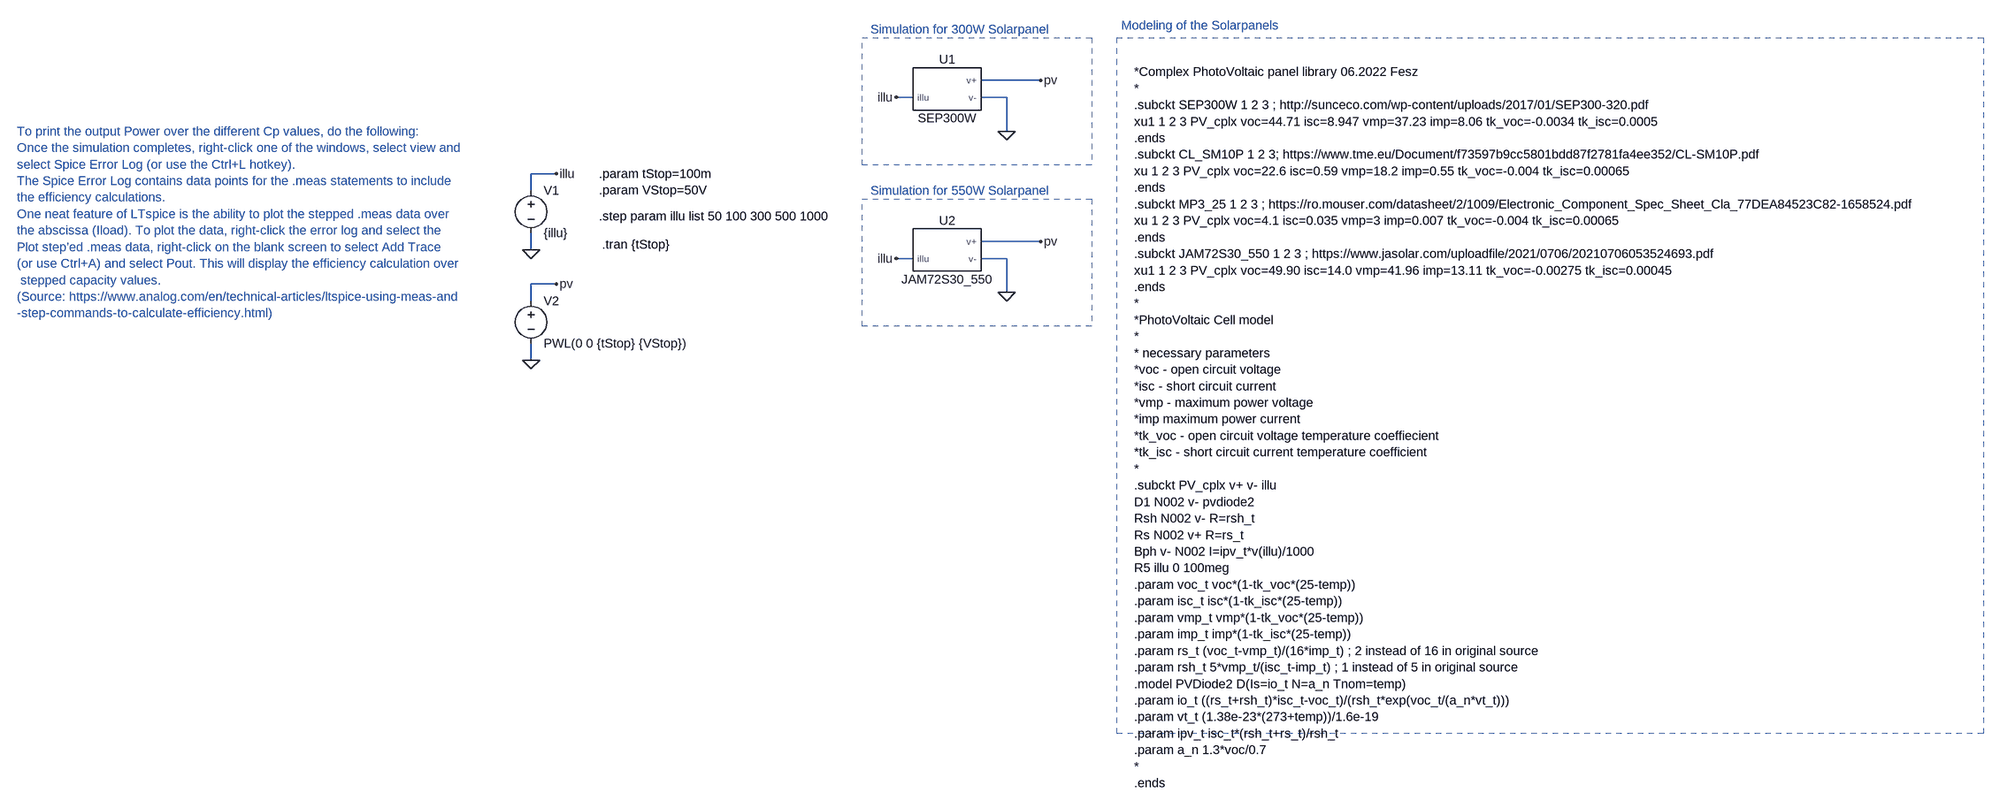
[diagram p0: schematic pv-panel-input.asc]
pv-panel-input.asc, the LTspice schematic file:
Version 4
SHEET 1 2356 1348
WIRE -1248 112 -1360 112
WIRE -1488 144 -1520 144
WIRE -1312 144 -1360 144
WIRE -1312 208 -1312 144
WIRE -2160 288 -2208 288
WIRE -2208 320 -2208 288
WIRE -1248 416 -1360 416
WIRE -2208 432 -2208 400
WIRE -1488 448 -1520 448
WIRE -1312 448 -1360 448
WIRE -2160 496 -2208 496
WIRE -1312 512 -1312 448
WIRE -2208 528 -2208 496
WIRE -2208 640 -2208 608
FLAG -2208 432 0
FLAG -1312 208 0
FLAG -2160 288 illu
FLAG -1520 144 illu
FLAG -1312 512 0
FLAG -1520 448 illu
FLAG -2208 640 0
FLAG -2160 496 pv
FLAG -1248 112 pv
FLAG -1248 416 pv
SYMBOL PV_cplx -1424 128 R0
SYMATTR InstName U1
SYMATTR Value SEP300W
SYMBOL voltage -2208 304 R0
WINDOW 123 0 0 Left 0
WINDOW 39 0 0 Left 0
SYMATTR InstName V1
SYMATTR Value {illu}
SYMBOL PV_cplx -1424 432 R0
SYMATTR InstName U2
SYMATTR Value JAM72S30_550
SYMBOL voltage -2208 512 R0
WINDOW 123 0 0 Left 0
WINDOW 39 0 0 Left 0
SYMATTR InstName V2
SYMATTR Value PWL(0 0 {tStop} {VStop})
TEXT -1072 96 Left 2 !*Complex PhotoVoltaic panel library 06.2022 Fesz\n*\n.subckt SEP300W 1 2 3 ; http://sunceco.com/wp-content/uploads/2017/01/SEP300-320.pdf\nxu1 1 2 3 PV_cplx voc=44.71 isc=8.947 vmp=37.23 imp=8.06 tk_voc=-0.0034 tk_isc=0.0005\n.ends\n.subckt CL_SM10P 1 2 3; https://www.tme.eu/Document/f73597b9cc5801bdd87f2781fa4ee352/CL-SM10P.pdf\nxu 1 2 3 PV_cplx voc=22.6 isc=0.59 vmp=18.2 imp=0.55 tk_voc=-0.004 tk_isc=0.00065\n.ends\n.subckt MP3_25 1 2 3 ; https://ro.mouser.com/datasheet/2/1009/Electronic_Component_Spec_Sheet_Cla_77DEA84523C82-1658524.pdf\nxu 1 2 3 PV_cplx voc=4.1 isc=0.035 vmp=3 imp=0.007 tk_voc=-0.004 tk_isc=0.00065\n.ends\n.subckt JAM72S30_550 1 2 3 ; https://www.jasolar.com/uploadfile/2021/0706/20210706053524693.pdf\nxu1 1 2 3 PV_cplx voc=49.90 isc=14.0 vmp=41.96 imp=13.11 tk_voc=-0.00275 tk_isc=0.00045\n.ends\n*\n*PhotoVoltaic Cell model\n*\n* necessary parameters\n*voc - open circuit voltage\n*isc - short circuit current\n*vmp - maximum power voltage\n*imp maximum power current\n*tk_voc - open circuit voltage temperature coeffiecient\n*tk_isc - short circuit current temperature coefficient\n*\n.subckt PV_cplx v+ v- illu \nD1 N002 v- pvdiode2\nRsh N002 v- R=rsh_t\nRs N002 v+ R=rs_t\nBph v- N002 I=ipv_t*v(illu)/1000\nR5 illu 0 100meg\n.param voc_t voc*(1-tk_voc*(25-temp))\n.param isc_t isc*(1-tk_isc*(25-temp))\n.param vmp_t vmp*(1-tk_voc*(25-temp))\n.param imp_t imp*(1-tk_isc*(25-temp))\n.param rs_t (voc_t-vmp_t)/(16*imp_t) ; 2 instead of 16 in original source\n.param rsh_t 5*vmp_t/(isc_t-imp_t) ; 1 instead of 5 in original source\n.model PVDiode2 D(Is=io_t N=a_n Tnom=temp)\n.param io_t ((rs_t+rsh_t)*isc_t-voc_t)/(rsh_t*exp(voc_t/(a_n*vt_t)))\n.param vt_t (1.38e-23*(273+temp))/1.6e-19\n.param ipv_t isc_t*(rsh_t+rs_t)/rsh_t\n.param a_n 1.3*voc/0.7\n*\n.ends
TEXT -2080 288 Left 2 !.param tStop=100m\n.param VStop=50V
TEXT -3280 208 Left 2 ;To print the output Power over the different Cp values, do the following:\nOnce the simulation completes, right-click one of the windows, select view and\nselect Spice Error Log (or use the Ctrl+L hotkey). \nThe Spice Error Log contains data points for the .meas statements to include \nthe efficiency calculations.\nOne neat feature of LTspice is the ability to plot the stepped .meas data over \nthe abscissa (Iload). To plot the data, right-click the error log and select the \nPlot step’ed .meas data, right-click on the blank screen to select Add Trace \n(or use Ctrl+A) and select Pout. This will display the efficiency calculation over\n stepped capacity values.\n(Source: https://www.analog.com/en/technical-articles/ltspice-using-meas-and\n-step-commands-to-calculate-efficiency.html)
TEXT -1568 16 Left 2 ;Simulation for 300W Solarpanel
TEXT -1568 320 Left 2 ;Simulation for 550W Solarpanel
TEXT -1096 8 Left 2 ;Modeling of the Solarpanels
TEXT -2074 422 Left 2 !.tran {tStop}
TEXT -2080 368 Left 2 !.step param illu list 50 100 300 500 1000
RECTANGLE Normal -1152 272 -1584 32 2
RECTANGLE Normal -1152 576 -1584 336 2
RECTANGLE Normal 528 1344 -1104 32 2

The netlist it stands for:
* pv-panel-input.asc
XU1 pv 0 illu SEP300W  ; pins v+ v- illu
V1 illu 0 {illu}
XU2 pv 0 illu JAM72S30_550  ; pins v+ v- illu
V2 pv 0 PWL(0 0 {tStop} {VStop})
*Complex PhotoVoltaic panel library 06.2022 Fesz
*
.subckt SEP300W 1 2 3 ; http://sunceco.com/wp-content/uploads/2017/01/SEP300-320.pdf
xu1 1 2 3 PV_cplx voc=44.71 isc=8.947 vmp=37.23 imp=8.06 tk_voc=-0.0034 tk_isc=0.0005
.ends
.subckt CL_SM10P 1 2 3; https://www.tme.eu/Document/f73597b9cc5801bdd87f2781fa4ee352/CL-SM10P.pdf
xu 1 2 3 PV_cplx voc=22.6 isc=0.59 vmp=18.2 imp=0.55 tk_voc=-0.004 tk_isc=0.00065
.ends
.subckt MP3_25 1 2 3 ; https://ro.mouser.com/datasheet/2/1009/Electronic_Component_Spec_Sheet_Cla_77DEA84523C82-1658524.pdf
xu 1 2 3 PV_cplx voc=4.1 isc=0.035 vmp=3 imp=0.007 tk_voc=-0.004 tk_isc=0.00065
.ends
.subckt JAM72S30_550 1 2 3 ; https://www.jasolar.com/uploadfile/2021/0706/20210706053524693.pdf
xu1 1 2 3 PV_cplx voc=49.90 isc=14.0 vmp=41.96 imp=13.11 tk_voc=-0.00275 tk_isc=0.00045
.ends
*
*PhotoVoltaic Cell model
*
* necessary parameters
*voc - open circuit voltage
*isc - short circuit current
*vmp - maximum power voltage
*imp maximum power current
*tk_voc - open circuit voltage temperature coeffiecient
*tk_isc - short circuit current temperature coefficient
*
.subckt PV_cplx v+ v- illu
D1 N002 v- pvdiode2
Rsh N002 v- R=rsh_t
Rs N002 v+ R=rs_t
Bph v- N002 I=ipv_t*v(illu)/1000
R5 illu 0 100meg
.param voc_t voc*(1-tk_voc*(25-temp))
.param isc_t isc*(1-tk_isc*(25-temp))
.param vmp_t vmp*(1-tk_voc*(25-temp))
.param imp_t imp*(1-tk_isc*(25-temp))
.param rs_t (voc_t-vmp_t)/(16*imp_t) ; 2 instead of 16 in original source
.param rsh_t 5*vmp_t/(isc_t-imp_t) ; 1 instead of 5 in original source
.model PVDiode2 D(Is=io_t N=a_n Tnom=temp)
.param io_t ((rs_t+rsh_t)*isc_t-voc_t)/(rsh_t*exp(voc_t/(a_n*vt_t)))
.param vt_t (1.38e-23*(273+temp))/1.6e-19
.param ipv_t isc_t*(rsh_t+rs_t)/rsh_t
.param a_n 1.3*voc/0.7
*
.ends
.param tStop=100m
.param VStop=50V
* To print the output Power over the different Cp values, do the following:
* Once the simulation completes, right-click one of the windows, select view and
* select Spice Error Log (or use the Ctrl+L hotkey).
* The Spice Error Log contains data points for the .meas statements to include
* the efficiency calculations.
* One neat feature of LTspice is the ability to plot the stepped .meas data over
* the abscissa (Iload). To plot the data, right-click the error log and select the
* Plot step’ed .meas data, right-click on the blank screen to select Add Trace
* (or use Ctrl+A) and select Pout. This will display the efficiency calculation over
*  stepped capacity values.
* (Source: https://www.analog.com/en/technical-articles/ltspice-using-meas-and
* -step-commands-to-calculate-efficiency.html)
* Simulation for 300W Solarpanel
* Simulation for 550W Solarpanel
* Modeling of the Solarpanels
.tran {tStop}
.step param illu list 50 100 300 500 1000
.backanno
.end